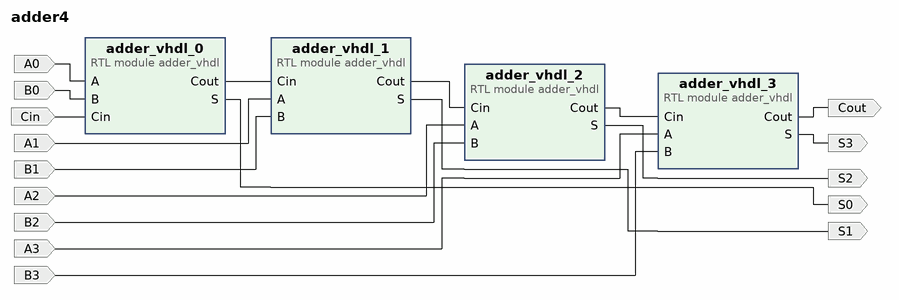
[diagram p0: block diagram of the top level]
# Vivado block design adder4, xc7a35tcpg236-1, Vivado 2018.2
create_bd_design adder4

create_bd_port -dir I A0
create_bd_port -dir I B0
create_bd_port -dir I Cin
create_bd_port -dir I A1
create_bd_port -dir I B1
create_bd_port -dir I A2
create_bd_port -dir I B2
create_bd_port -dir I A3
create_bd_port -dir I B3
create_bd_port -dir O S0
create_bd_port -dir O S1
create_bd_port -dir O S2
create_bd_port -dir O S3
create_bd_port -dir O Cout

create_bd_cell -type module -reference adder_vhdl adder_vhdl_0
create_bd_cell -type module -reference adder_vhdl adder_vhdl_1
create_bd_cell -type module -reference adder_vhdl adder_vhdl_2
create_bd_cell -type module -reference adder_vhdl adder_vhdl_3

# ---- connections ----

connect_bd_net -net A0_1 [get_bd_ports A0] [get_bd_pins adder_vhdl_0/A]
connect_bd_net -net B0_1 [get_bd_ports B0] [get_bd_pins adder_vhdl_0/B]
connect_bd_net -net A1_1 [get_bd_ports A1] [get_bd_pins adder_vhdl_1/A]
connect_bd_net -net B1_1 [get_bd_ports B1] [get_bd_pins adder_vhdl_1/B]
connect_bd_net -net A2_1 [get_bd_ports A2] [get_bd_pins adder_vhdl_2/A]
connect_bd_net -net B2_1 [get_bd_ports B2] [get_bd_pins adder_vhdl_2/B]
connect_bd_net -net A3_1 [get_bd_ports A3] [get_bd_pins adder_vhdl_3/A]
connect_bd_net -net B3_1 [get_bd_ports B3] [get_bd_pins adder_vhdl_3/B]
connect_bd_net [get_bd_ports Cin] [get_bd_pins adder_vhdl_0/Cin]
connect_bd_net [get_bd_pins adder_vhdl_0/Cout] [get_bd_pins adder_vhdl_1/Cin]
connect_bd_net [get_bd_pins adder_vhdl_1/Cout] [get_bd_pins adder_vhdl_2/Cin]
connect_bd_net [get_bd_pins adder_vhdl_2/Cout] [get_bd_pins adder_vhdl_3/Cin]
connect_bd_net [get_bd_pins adder_vhdl_3/Cout] [get_bd_ports Cout]
connect_bd_net [get_bd_pins adder_vhdl_3/S] [get_bd_ports S3]
connect_bd_net [get_bd_pins adder_vhdl_2/S] [get_bd_ports S2]
connect_bd_net [get_bd_pins adder_vhdl_0/S] [get_bd_ports S0]
connect_bd_net [get_bd_pins adder_vhdl_1/S] [get_bd_ports S1]

validate_bd_design
save_bd_design
